# EasyEDA Pro project ProPrj_GlowPolyDriver_2025-09-27.epro

# Schematic Schematic1
Board Name: Board1; Create Date: 2025-09-27; Page Name: P1; Project Name: GlowPolyDriver; Schematic Name: Schematic1; Update Date: 2025-09-27; Company: EasyEDA.com; Page Size: A4; Version: V1.0
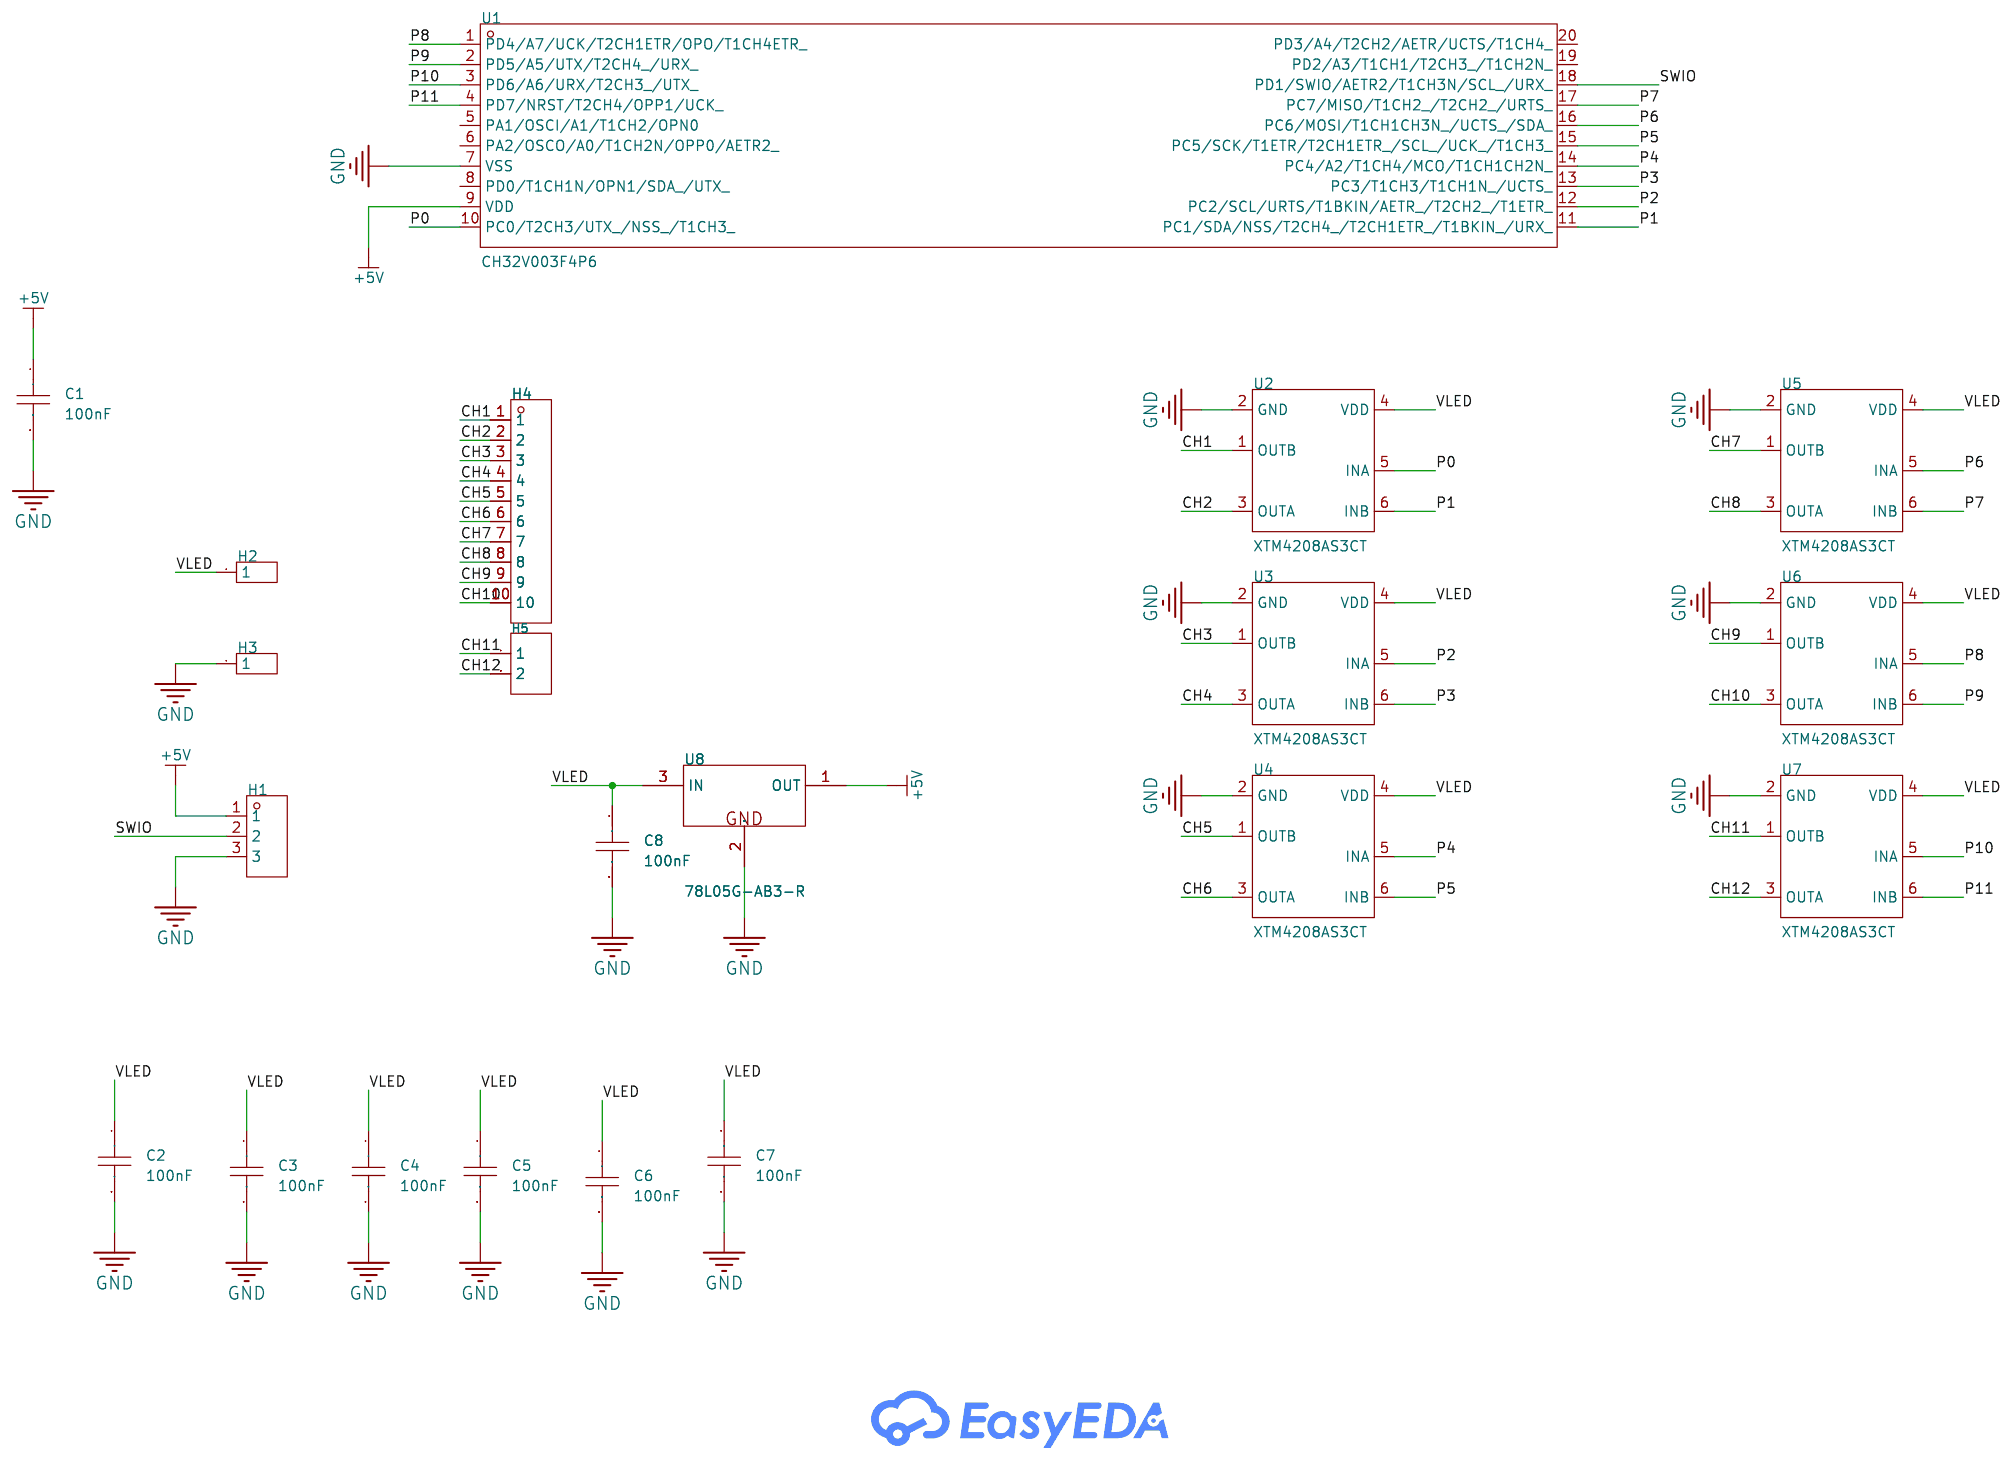
[diagram p0: schematic sheet]

## Parts
C1  100nF  [C0603]
C2  100nF  [C0603]
C3  100nF  [C0603]
C4  100nF  [C0603]
C5  100nF  [C0603]
C6  100nF  [C0603]
C7  100nF  [C0603]
C8  100nF  [C0603]
H1  -  [HDR-TH_3P-P2.54-V-F]
H2  -  [HDR-TH_1P-V-M_XKB_X4611WV-01I-C28D40]
H3  -  [HDR-TH_1P-V-M_XKB_X4611WV-01I-C28D40]
H4  -  [HDR-TH_10P-P2.54-V-F]
H5  -  [HDR-TH_2P-P2.54-V-F]
U1  CH32V003F4P6  [TSSOP-20_L6.5-W4.4-P0.65-LS6.4-BL]
U2  XTM4208AS3CT  [SOT-23-6_L2.9-W1.6-P0.95-LS2.8-BR]
U3  XTM4208AS3CT  [SOT-23-6_L2.9-W1.6-P0.95-LS2.8-BR]
U4  XTM4208AS3CT  [SOT-23-6_L2.9-W1.6-P0.95-LS2.8-BR]
U5  XTM4208AS3CT  [SOT-23-6_L2.9-W1.6-P0.95-LS2.8-BR]
U6  XTM4208AS3CT  [SOT-23-6_L2.9-W1.6-P0.95-LS2.8-BR]
U7  XTM4208AS3CT  [SOT-23-6_L2.9-W1.6-P0.95-LS2.8-BR]
U8  78L05G-AB3-R  [SOT-89-3_L4.5-W2.5-P1.50-LS4.2-BR]

## Library data of the parts
C1-C8 = CAP_0603: Supplier Footprint: 0603
H1 = HDR-F_2.54_1x3P: Supplier Footprint: Through
H2 H3 = HDR-M_2.54_1x1P: Supplier Footprint: Through
H4 = HDR-F_2.54_1x10P: Supplier Footprint: Through
H5 = HDR-F_2.54_1x2P: Supplier Footprint: Through
U1 = CH32V003F4P6: LCSC Part Name: QingKe V2微处理器; Supplier Part: C5187096; Manufacturer: WCH(南京沁恒); Supplier Footprint: TSSOP-20-175mil; JLCPCB Part Class: Extended Part; Datasheet: https://item.szlcsc.com/datasheet/CH32V003F4P6/5858783.html; Supplier: LCSC
U2-U7 = XTM4208AS3CT: Technology:Yes Output Current:500mA Output Current:500mA Peak Current:800mA Voltage - Supply:2.4V~18V Voltage - Supply:2.4V~18V RDS(on):2Ω Quiescent Current(Iq):1uA Operating Temperature:-40℃~+85℃ Operating Temperature:-40℃~+85℃; Supplier Part: C41430131; Manufacturer: XTX(芯天下); Supplier Footprint: SOT-23-6; JLCPCB Part Class: Extended Part; Datasheet: https://item.szlcsc.com/datasheet/XTM4208AS3CT/43285025.html; Supplier: LCSC; Technology: Yes; Output Current: 500mA; Peak Current: 800mA; Voltage - Supply: 2.4V~18V; RDS(on): 2Ω; Quiescent Current(Iq): 1uA; Operating Temperature: -40℃~+85℃
U8 = 78L05G-AB3-R: Output Type:Fixed Voltage - Supply:30V Output Voltage:5V Output Voltage:5V Output Current:100mA Power Supply Rejection Ratio (PSRR):- Voltage Dropout:1.7V@(40mA) Noise:- Features:Short Circuit Protection；Over Temperature Protection；Over Current Protection; LCSC Part Name: 输入30V 输出5V 100mA; Supplier Part: C71136; Manufacturer: UTC(友顺); Supplier Footprint: SOT-89-3; JLCPCB Part Class: Basic Part; Datasheet: https://item.szlcsc.com/datasheet/78L05G-AB3-R/72235.html; Supplier: LCSC; Output Type: Fixed; Voltage - Supply: 30V; Output Voltage: 5V; Output Current: 100mA; Voltage Dropout: 1.7V@(40mA); Features: Short Circuit Protection；Over Temperature Protection；Over Current Protection; Operating Temperature: -40℃~+85℃; Output Configuration: Positive; Number of Outputs: 1

## Nets
+5V: C1.1 H1.1 U1.9(VDD) U8.1(OUT)
GND: C1.2 C2.2 C3.2 C4.2 C5.2 C6.2 C7.2 C8.2 H1.3 H3.1 U1.7(VSS) U2.2(GND) U3.2(GND) U4.2(GND) U5.2(GND) U6.2(GND) U7.2(GND) U8.2(GND)
CH1: H4.1 U2.1(OUTB)
CH2: H4.2 U2.3(OUTA)
CH3: H4.3 U3.1(OUTB)
CH4: H4.4 U3.3(OUTA)
CH5: H4.5 U4.1(OUTB)
CH6: H4.6 U4.3(OUTA)
CH7: H4.7 U5.1(OUTB)
CH8: H4.8 U5.3(OUTA)
CH9: H4.9 U6.1(OUTB)
CH10: H4.10 U6.3(OUTA)
CH11: H5.1 U7.1(OUTB)
CH12: H5.2 U7.3(OUTA)
P0: U1.10(PC0/T2CH3/UTX_/NSS_/T1CH3_) U2.5(INA)
P1: U1.11(PC1/SDA/NSS/T2CH4_/T2CH1ETR_/T1BKIN_/URX_) U2.6(INB)
P2: U1.12(PC2/SCL/URTS/T1BKIN/AETR_/T2CH2_/T1ETR_) U3.5(INA)
P3: U1.13(PC3/T1CH3/T1CH1N_/UCTS_) U3.6(INB)
P4: U1.14(PC4/A2/T1CH4/MCO/T1CH1CH2N_) U4.5(INA)
P5: U1.15(PC5/SCK/T1ETR/T2CH1ETR_/SCL_/UCK_/T1CH3_) U4.6(INB)
P6: U1.16(PC6/MOSI/T1CH1CH3N_/UCTS_/SDA_) U5.5(INA)
P7: U1.17(PC7/MISO/T1CH2_/T2CH2_/URTS_) U5.6(INB)
P8: U1.1(PD4/A7/UCK/T2CH1ETR/OPO/T1CH4ETR_) U6.5(INA)
P9: U1.2(PD5/A5/UTX/T2CH4_/URX_) U6.6(INB)
P10: U1.3(PD6/A6/URX/T2CH3_/UTX_) U7.5(INA)
P11: U1.4(PD7/NRST/T2CH4/OPP1/UCK_) U7.6(INB)
SWIO: H1.2 U1.18(PD1/SWIO/AETR2/T1CH3N/SCL_/URX_)
VLED: C2.1 C3.1 C4.1 C5.1 C6.1 C7.1 C8.1 H2.1 U2.4(VDD) U3.4(VDD) U4.4(VDD) U5.4(VDD) U6.4(VDD) U7.4(VDD) U8.3(IN)

Not connected (* = marked no-connect by the designer): U1 5(PA1/OSCI/A1/T1CH2/OPN0) 6(PA2/OSCO/A0/T1CH2N/OPP0/AETR2_) 8(PD0/T1CH1N/OPN1/SDA_/UTX_) 19(PD2/A3/T1CH1/T2CH3_/T1CH2N_) 20(PD3/A4/T2CH2/AETR/UCTS/T1CH4_)

# Board PCB1
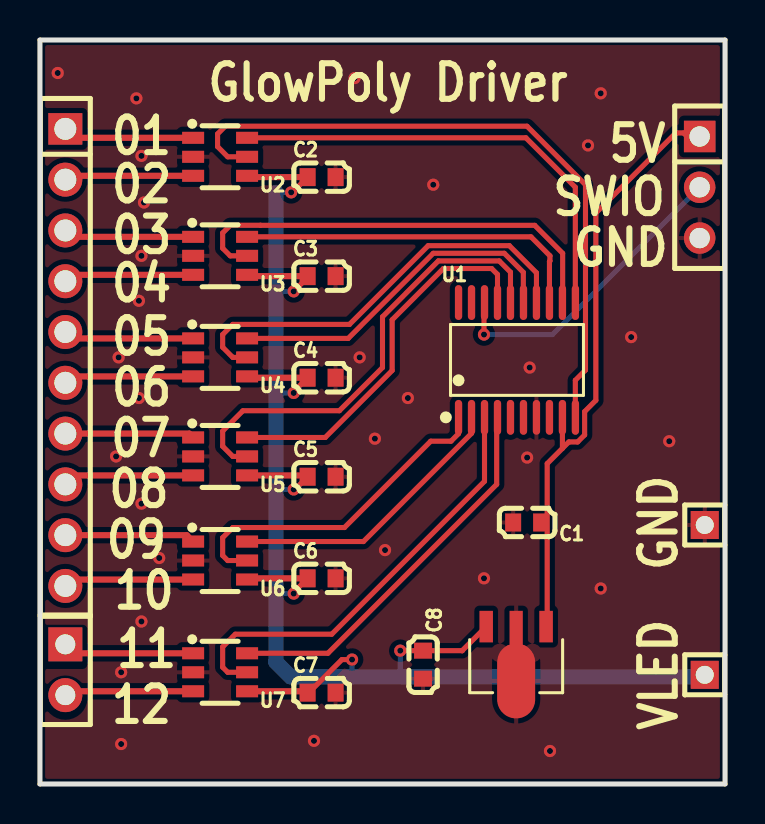
[diagram p1: board, top side]
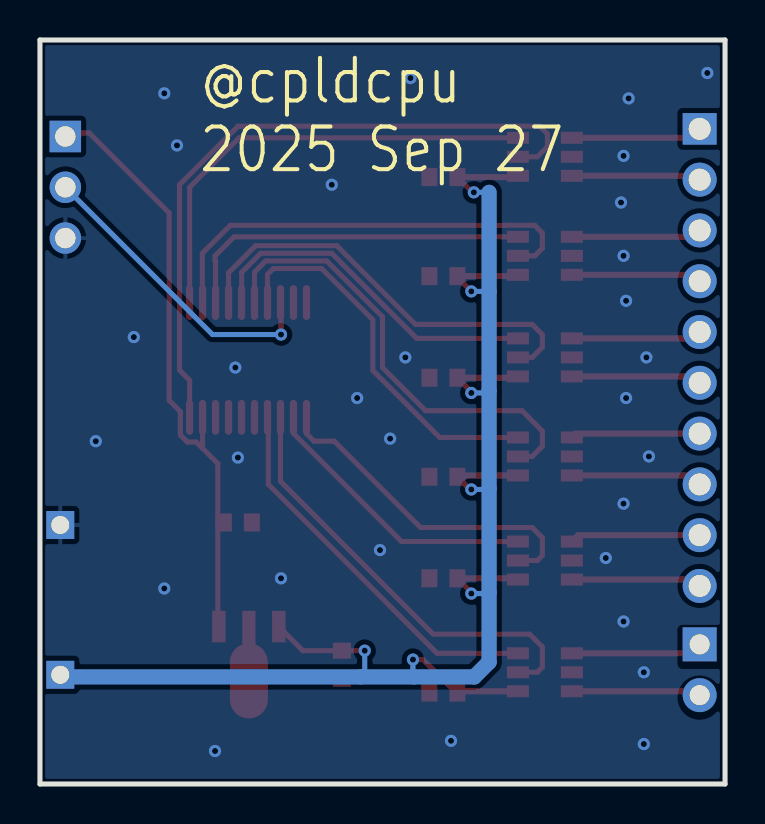
[diagram p2: board, bottom side, seen from below]

Outline 34.29 x 37.21 mm; copper layers: Top Layer, Bottom Layer. Coordinates in mm from the lower left corner of the outline.
Outline path: 0,37.21 0,0 34.29,0 34.29,37.21 0,37.21
Stack: Top Layer 0.035mm / Dielectric1 1.51mm FR4 er 4.5 / Bottom Layer 0.035mm

## Design rules (mm)
template: JLCPCB Capability(Two Layers Board)
spacing copperThickness1oz (default): track to track 0.102, other pairs 0.152 to 0.3
spacing copperThickness2oz: track to track 0.203, other pairs 0.152 to 0.3
track width copperThickness1oz (default): min 0.127, default 0.254, max 2.54
track width copperThickness2oz: min 0.203, default 0.254, max 2.54
differential pair differentialPair (default): width min 0.127, default 0.254, max 2.54; gap min 0.152, default 0.152
via viaSize (default): diameter min 0.5, default 0.61, max 10; hole min 0.3, default 0.305, max 6.3

## Placement (name value [footprint] x y rotation side)
C1  100nF  [C0603]  24.38 13.08 180 top
C2  100nF  [C0603]  14.1 30.35 0 top
C3  100nF  [C0603]  14.1 25.4 0 top
C4  100nF  [C0603]  14.1 20.32 0 top
C5  100nF  [C0603]  14.1 15.37 0 top
C6  100nF  [C0603]  14.1 10.29 0 top
C7  100nF  [C0603]  14.1 4.57 0 top
C8  100nF  [C0603]  19.18 5.97 270 top
H1  -  [HDR-TH_3P-P2.54-V-F]  33.02 29.84 270 top
H2  -  [HDR-TH_1P-V-M_XKB_X4611WV-01I-C28D40]  33.27 5.46 0 top
H3  -  [HDR-TH_1P-V-M_XKB_X4611WV-01I-C28D40]  33.27 12.95 0 top
H4  -  [HDR-TH_10P-P2.54-V-F]  1.27 21.34 270 top
H5  -  [HDR-TH_2P-P2.54-V-F]  1.27 5.71 270 top
U1  CH32V003F4P6  [TSSOP-20_L6.5-W4.4-P0.65-LS6.4-BL]  23.88 21.21 0 top
U2  XTM4208AS3CT  [SOT-23-6_L2.9-W1.6-P0.95-LS2.8-BR]  9.02 31.37 180 top
U3  XTM4208AS3CT  [SOT-23-6_L2.9-W1.6-P0.95-LS2.8-BR]  9.02 26.42 180 top
U4  XTM4208AS3CT  [SOT-23-6_L2.9-W1.6-P0.95-LS2.8-BR]  9.02 21.34 180 top
U5  XTM4208AS3CT  [SOT-23-6_L2.9-W1.6-P0.95-LS2.8-BR]  9.02 16.38 180 top
U6  XTM4208AS3CT  [SOT-23-6_L2.9-W1.6-P0.95-LS2.8-BR]  9.02 11.18 180 top
U7  XTM4208AS3CT  [SOT-23-6_L2.9-W1.6-P0.95-LS2.8-BR]  9.02 5.59 180 top
U8  78L05G-AB3-R  [SOT-89-3_L4.5-W2.5-P1.50-LS4.2-BR]  23.84 6.52 90 top

## Footprints (pads in the part's own frame, mm; a bottom-side part is the same pattern mirrored in y, then rotated)
C0603
  rect 0.8x0.9 smd: 1(-0.7,0) 2(0.7,0)
HDR-TH_1P-V-M_XKB_X4611WV-01I-C28D40
  rect 1.4x1.4 hole 0.9: 1(0,0)
HDR-TH_2P-P2.54-V-F
  rect 1.7x1.7 hole 1: 1(-1.27,0)
  round 1.7 hole 1: 2(1.27,0)
HDR-TH_3P-P2.54-V-F
  rect 1.575x1.575 hole 1.02: 1(-2.54,0)
  round 1.575 hole 1.02: 2(0,0) 3(2.54,0)
HDR-TH_10P-P2.54-V-F
  rect 1.575x1.7 hole 1.1: 1(-11.43,0)
  round 1.7 hole 1.1: 2(-8.89,0) 3(-6.35,0) 4(-3.81,0) 5(-1.27,0) 6(1.27,0) 7(3.81,0) 8(6.35,0) 9(8.89,0) 10(11.43,0)
SOT-23-6_L2.9-W1.6-P0.95-LS2.8-BR
  rect 1.1x0.6 smd: 1(1.35,-0.95) 2(1.35,0) 3(1.35,0.95) 4(-1.35,0.95) 5(-1.35,0) 6(-1.35,-0.95)
SOT-89-3_L4.5-W2.5-P1.50-LS4.2-BR
  rect 1.575x0.672 smd: 1(1.356,-1.5) 3(1.356,1.5)
  custom 5.377x1.9 smd: 2(-1.356,0)
TSSOP-20_L6.5-W4.4-P0.65-LS6.4-BL
  oval 0.364x1.742 smd: 1(-2.925,-2.871) 2(-2.275,-2.871) 3(-1.625,-2.871) 4(-0.975,-2.871) 5(-0.325,-2.871) 6(0.325,-2.871) 7(0.975,-2.871) 8(1.625,-2.871) 9(2.275,-2.871) 10(2.925,-2.871) 11(2.925,2.871) 12(2.275,2.871) 13(1.625,2.871) 14(0.975,2.871) 15(0.325,2.871) 16(-0.325,2.871) 17(-0.975,2.871) 18(-1.625,2.871) 19(-2.275,2.871) 20(-2.925,2.871)

## Nets
As in the schematic.

Pads without a net: U1 5 6 8 19 20

## Via types
v1: diameter 0.61, hole 0.305, Top Layer to Bottom Layer, 38 vias

## Routing (per net, layer and track width the routed paths; a pad name or vN(x,y) marks a point on that pad's centre or on a via; arc(x,y) is an arc through that point)
+5V: length 30.3
  Top Layer w0.254: 25.39,7.93 25.39,16.03 26.15,16.79 ; 25.39,7.93 25.4,7.94 ; 25.39,7.93 U8.1 ; 32.89,32.38 32.39,32.38 32.21,32.56 31.83,32.56 27.82,28.56 27.82,19.19 27.26,18.63 27.26,17.46 26.91,17.11 26.47,17.11 26.15,16.79 ; 26.15,16.79 U1.9
GND:
  vias: v1(0.89,35.56) v1(3.81,16.38) v1(3.94,21.34) v1(4.06,5.59) v1(4.06,2) v1(4.83,34.29) v1(4.95,24.17) v1(4.95,19.3) v1(5.08,31.41) v1(5.08,26.42) v1(5.08,14.02) v1(5.08,8.13) v1(5.21,29.08) v1(5.97,11.3) v1(13.72,2.16) v1(15.75,35.31) v1(16,21.34) v1(16.76,17.27) v1(17.27,11.7) v1(18.41,19.3) v1(19.69,29.97) v1(22.22,10.29) v1(24.38,16.33) v1(24.51,20.83) v1(25.53,1.65) v1(27.43,31.94) v1(28.07,34.54) v1(28.07,9.78) v1(29.59,22.35) v1(31.5,17.14)
CH1: length 6.6
  Top Layer w0.305: H4.1 1.72,32.32 U2.1
CH2: length 6.5
  Top Layer w0.305: U2.3 1.46,30.42 H4.2
CH3: length 6.5
  Top Layer w0.305: H4.3 1.59,27.37 U3.1
CH4: length 6.5
  Top Layer w0.305: U3.3 1.59,25.47 H4.4
CH5: length 6.5
  Top Layer w0.305: U4.1 1.59,22.29 H4.5
CH6: length 6.5
  Top Layer w0.305: H4.6 1.59,20.39 U4.3
CH7: length 6.5
  Top Layer w0.305: U5.1 7.47,17.53 H4.7
CH8: length 6.6
  Top Layer w0.305: U5.3 1.72,15.43 H4.8
CH9: length 6.5
  Top Layer w0.305: U6.1 7.35,12.45 H4.9
CH10: length 6.5
  Top Layer w0.305: U6.3 1.59,10.23 H4.10
CH11: length 6.5
  Top Layer w0.305: 1.27,6.86 1.59,6.54 U7.1
CH12: length 6.5
  Top Layer w0.305: 1.27,4.32 1.59,4.64 U7.3
P0: length 34
  Top Layer w0.254: 26.8,18.34 26.8,18.34 26.8,20.19 27.31,20.7 27.31,29.97 24.38,32.9 9.28,32.9 8.89,32.51 8.89,31.88 9.4,31.37 U2.5
P1: length 23.2
  Top Layer w0.254: U2.6 24.32,32.32 26.8,29.84 26.8,24.08 26.8,24.08
P2: length 22.4
  Top Layer w0.254: U3.5 9.53,26.42 9.14,26.8 9.14,27.56 9.53,27.94 9.7,27.94 9.7,27.94 11.03,27.94 11.04,27.94 24.76,27.94 26.16,26.54 26.16,24.09 U1.12
P3: length 17.9
  Top Layer w0.254: U3.6 24.58,27.37 25.53,26.42 25.53,26.16 25.5,26.14 U1.13
P4: length 21.7
  Top Layer w0.254: U1.14 24.85,25.57 23.5,26.92 19.43,26.92 15.49,22.99 9.65,22.99 9.14,22.48 9.14,21.84 9.65,21.34 U4.5
P5: length 17.5
  Top Layer w0.254: U1.15 24.19,24.09 24.19,25.59 23.24,26.54 19.69,26.54 15.43,22.29 U4.6
P6: length 23.4
  Top Layer w0.254: U5.5 9.65,16.38 9.14,16.89 9.14,17.65 10.16,18.67 14.99,18.67 17.15,20.83 17.15,23.37 19.94,26.16 22.99,26.16 23.55,25.6 U1.16
P7: length 19
  Top Layer w0.254: U1.17 22.9,25.49 22.61,25.78 20.19,25.78 17.63,23.22 17.63,20.68 14.28,17.33 U5.6
P8: length 17
  Top Layer w0.254: U6.5 9.4,11.18 9.14,11.43 9.14,12.32 9.65,12.83 15.24,12.83 19.56,17.14 20.57,17.14 20.95,17.52 U1.1
P9: length 14.3
  Top Layer w0.254: U1.2 21.6,17.54 16.19,12.13 U6.6
P10: length 22.1
  Top Layer w0.254: U7.5 9.4,5.59 9.14,5.84 9.14,6.86 9.78,7.49 14.6,7.49 22.25,15.14 U1.3
P11: length 19.4
  Top Layer w0.254: U7.6 14.41,6.54 22.86,14.99 22.86,18.3 U1.4
SWIO: length 15.4
  Top Layer w0.254: v1(22.22,22.48) 22.22,24.05 U1.18
  Bottom Layer w0.254: v1(22.22,22.48) 25.65,22.48 32.89,29.72 32.89,29.84
VLED: length 83
  Top Layer w0.254: 21.13,6.67 C8.1 v1(18.03,6.67) ; 21.13,6.67 U8.3 ; 21.13,6.67 21.14,6.66 ; v1(12.57,29.59) 12.63,29.59 13.4,30.35 ; 13.4,4.57 13.46,4.57 15.11,6.22 v1(15.62,6.22) ; 13.4,10.29 12.7,9.59 v1(12.7,9.52) ; v1(12.7,19.56) 12.7,19.62 13.4,20.32 ; v1(12.7,24.64) 13.4,25.33 13.4,25.4 ; v1(12.7,14.73) 12.76,14.73 13.4,15.37
  Top Layer w0.305: U4.4 10.43,20.32 13.4,20.32 ; 13.4,15.37 13.33,15.43 U5.4 ; U7.4 13.33,4.64 13.4,4.57 ; 13.4,25.4 10.43,25.4 U3.4 ; U6.4 10.43,10.29 13.4,10.29 ; U2.4 10.37,30.4 10.41,30.35 13.4,30.35
  Bottom Layer w0.254: v1(18.03,6.67) 18.03,5.54 18.22,5.36 ; v1(15.62,6.22) 15.62,5.41 15.57,5.36 ; v1(12.7,9.52) 11.86,9.52 11.81,9.57 ; v1(12.7,14.73) 11.86,14.73 11.81,14.78 ; 11.81,24.64 11.81,24.64 v1(12.7,24.64) ; v1(12.57,29.59) 11.81,29.59 ; v1(12.7,19.56) 11.91,19.56 11.81,19.66
  Bottom Layer w0.762: 11.81,29.59 11.81,6.1 12.55,5.36 32.77,5.36 32.97,5.56

## Copper pours and planes (outline as drawn; the poured copper is in the pictures)
GND on Top Layer: -3.94,40.51 36.7,40.51 36.7,-3.43 -3.94,-3.43
GND on Bottom Layer: -7.24,42.8 39.62,42.8 39.62,-7.24 -7.24,-7.24

## Text on the board
Bottom Silkscreen Layer: @cpldcpu / 2025 Sep 27
Top Silkscreen Layer: 09 | 08 | 07 | 01 | 12 | 02 | 03 | 04 | 05 | 06 | 10 | 11 | GlowPoly Driver | SWIO | GND | 5V | VLED
